# Altium schematic sheet 32.SchDoc
size A3
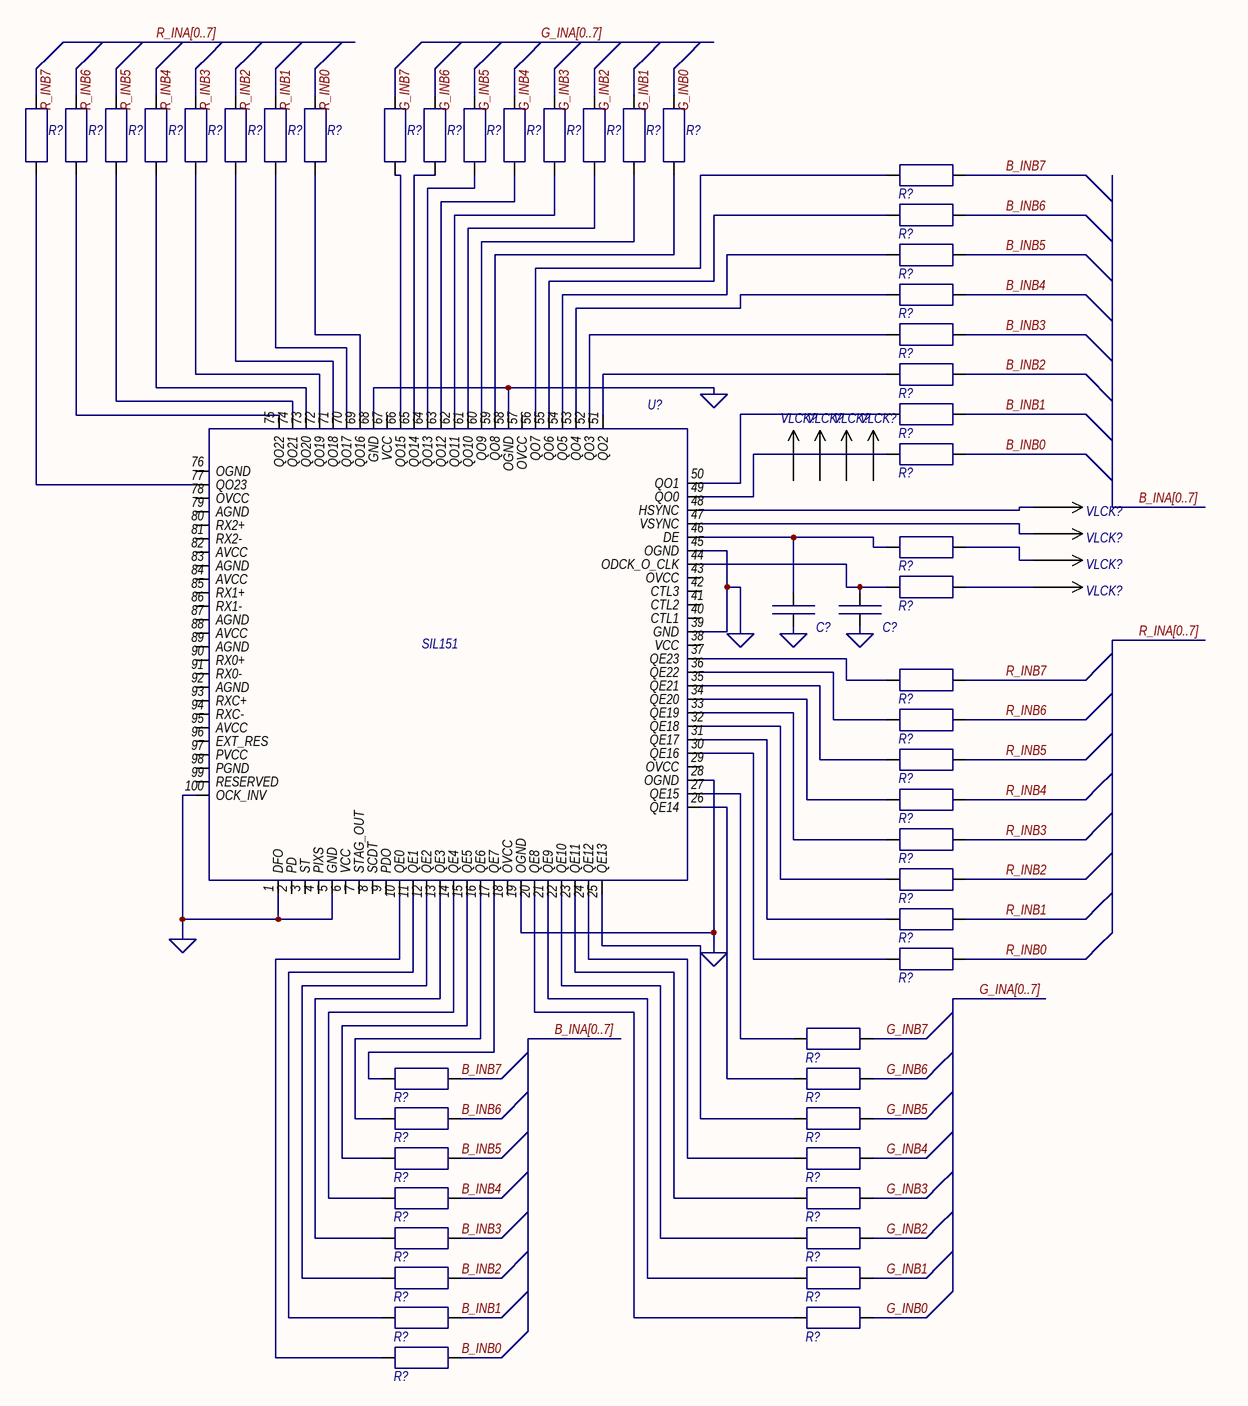
[diagram p0: 32.SchDoc]

## Parts
(Parts that share a designator on the sheet are numbered #1, #2 ... from top to bottom, then left to right.)
C?#1  Capacitor  [Cap_tantal_D]  (value not drawn)
C?#2  Capacitor  [Cap_tantal_D]  (value not drawn)
R?#1  Resistor  [R_1206]  (value not drawn)
R?#2  Resistor  [R_1206]  (value not drawn)
R?#3  Resistor  [R_1206]  (value not drawn)
R?#4  Resistor  [R_1206]  (value not drawn)
R?#5  Resistor  [R_1206]  (value not drawn)
R?#6  Resistor  [R_1206]  (value not drawn)
R?#7  Resistor  [R_1206]  (value not drawn)
R?#8  Resistor  [R_1206]  (value not drawn)
R?#9  Resistor  [R_1206]  (value not drawn)
R?#10  Resistor  [R_1206]  (value not drawn)
R?#11  Resistor  [R_1206]  (value not drawn)
R?#12  Resistor  [R_1206]  (value not drawn)
R?#13  Resistor  [R_1206]  (value not drawn)
R?#14  Resistor  [R_1206]  (value not drawn)
R?#15  Resistor  [R_1206]  (value not drawn)
R?#16  Resistor  [R_1206]  (value not drawn)
R?#17  Resistor  [R_1206]  (value not drawn)
R?#18  Resistor  [R_1206]  (value not drawn)
R?#19  Resistor  [R_1206]  (value not drawn)
R?#20  Resistor  [R_1206]  (value not drawn)
R?#21  Resistor  [R_1206]  (value not drawn)
R?#22  Resistor  [R_1206]  (value not drawn)
R?#23  Resistor  [R_1206]  (value not drawn)
R?#24  Resistor  [R_1206]  (value not drawn)
R?#25  Resistor  [R_1206]  (value not drawn)
R?#26  Resistor  [R_1206]  (value not drawn)
R?#27  Resistor  [R_1206]  (value not drawn)
R?#28  Resistor  [R_1206]  (value not drawn)
R?#29  Resistor  [R_1206]  (value not drawn)
R?#30  Resistor  [R_1206]  (value not drawn)
R?#31  Resistor  [R_1206]  (value not drawn)
R?#32  Resistor  [R_1206]  (value not drawn)
R?#33  Resistor  [R_1206]  (value not drawn)
R?#34  Resistor  [R_1206]  (value not drawn)
R?#35  Resistor  [R_1206]  (value not drawn)
R?#36  Resistor  [R_1206]  (value not drawn)
R?#37  Resistor  [R_1206]  (value not drawn)
R?#38  Resistor  [R_1206]  (value not drawn)
R?#39  Resistor  [R_1206]  (value not drawn)
R?#40  Resistor  [R_1206]  (value not drawn)
R?#41  Resistor  [R_1206]  (value not drawn)
R?#42  Resistor  [R_1206]  (value not drawn)
R?#43  Resistor  [R_1206]  (value not drawn)
R?#44  Resistor  [R_1206]  (value not drawn)
R?#45  Resistor  [R_1206]  (value not drawn)
R?#46  Resistor  [R_1206]  (value not drawn)
R?#47  Resistor  [R_1206]  (value not drawn)
R?#48  Resistor  [R_1206]  (value not drawn)
R?#49  Resistor  [R_1206]  (value not drawn)
R?#50  Resistor  [R_1206]  (value not drawn)
U?  SIL151
VLCK?#1  OutputArrow  (value not drawn)
VLCK?#2  OutputArrow  (value not drawn)
VLCK?#3  OutputArrow  (value not drawn)
VLCK?#4  OutputArrow  (value not drawn)
VLCK?#5  OutputArrow  (value not drawn)
VLCK?#6  OutputArrow  (value not drawn)
VLCK?#7  OutputArrow  (value not drawn)
VLCK?#8  OutputArrow  (value not drawn)

## Nets
GND: C?#1.1 C?#2.1 U?.1(DFO) U?.5(GND) U?.19(OGND) U?.28(OGND) U?.39(GND) U?.45(OGND) U?.58(OGND) U?.68(GND) U?.100(OCK_INV)
B_INB0: R?#24.2 R?#50.2
B_INB1: R?#23.2 R?#48.2
B_INB2: R?#22.2 R?#46.2
B_INB3: R?#21.2 R?#44.2
B_INB4: R?#20.2 R?#42.2
B_INB5: R?#19.2 R?#40.2
B_INB6: R?#18.2 R?#38.2
B_INB7: R?#1.2 R?#36.2
G_INA[0..7]: R?#13.2 R?#41.2  [also labelled G_INB4]
G_INB0: R?#17.2 R?#49.2
G_INB1: R?#16.2 R?#47.2
G_INB2: R?#15.2 R?#45.2
G_INB3: R?#14.2 R?#43.2
G_INB5: R?#12.2 R?#39.2
G_INB6: R?#11.2 R?#37.2
G_INB7: R?#10.2 R?#35.2
R_INB0: R?#9.2 R?#34.2
R_INB1: R?#8.2 R?#33.2
R_INB2: R?#7.2 R?#32.2
R_INB3: R?#6.2 R?#31.2
R_INB4: R?#5.2 R?#30.2
R_INB5: R?#4.2 R?#29.2
R_INB6: R?#3.2 R?#28.2
R_INB7: R?#2.2 R?#27.2
NetC?#1_2: C?#1.2 R?#25.1 U?.46(DE)
NetC?#2_2: C?#2.2 R?#26.1 U?.44(ODCK_O_CLK)
NetR?#1_1: R?#1.1 U?.56(QO7)
NetR?#2_1: R?#2.1 U?.77(QO23)
NetR?#3_1: R?#3.1 U?.75(QO22)
NetR?#4_1: R?#4.1 U?.74(QO21)
NetR?#5_1: R?#5.1 U?.73(QO20)
NetR?#6_1: R?#6.1 U?.72(QO19)
NetR?#7_1: R?#7.1 U?.71(QO18)
NetR?#8_1: R?#8.1 U?.70(QO17)
NetR?#9_1: R?#9.1 U?.69(QO16)
NetR?#10_1: R?#10.1 U?.66(QO15)
NetR?#11_1: R?#11.1 U?.65(QO14)
NetR?#12_1: R?#12.1 U?.64(QO13)
NetR?#13_1: R?#13.1 U?.63(QO12)
NetR?#14_1: R?#14.1 U?.62(QO11)
NetR?#15_1: R?#15.1 U?.61(QO10)
NetR?#16_1: R?#16.1 U?.60(QO9)
NetR?#17_1: R?#17.1 U?.59(QO8)
NetR?#18_1: R?#18.1 U?.55(QO6)
NetR?#19_1: R?#19.1 U?.54(QO5)
NetR?#20_1: R?#20.1 U?.53(QO4)
NetR?#21_1: R?#21.1 U?.52(QO3)
NetR?#22_1: R?#22.1 U?.51(QO2)
NetR?#23_1: R?#23.1 U?.50(QO1)
NetR?#24_1: R?#24.1 U?.49(QO0)
NetR?#25_2: R?#25.2 VLCK?#7.3
NetR?#26_2: R?#26.2 VLCK?#8.3
NetR?#27_1: R?#27.1 U?.37(QE23)
NetR?#28_1: R?#28.1 U?.36(QE22)
NetR?#29_1: R?#29.1 U?.35(QE21)
NetR?#30_1: R?#30.1 U?.34(QE20)
NetR?#31_1: R?#31.1 U?.33(QE19)
NetR?#32_1: R?#32.1 U?.32(QE18)
NetR?#33_1: R?#33.1 U?.31(QE17)
NetR?#34_1: R?#34.1 U?.30(QE16)
NetR?#35_1: R?#35.1 U?.27(QE15)
NetR?#36_1: R?#36.1 U?.17(QE7)
NetR?#37_1: R?#37.1 U?.26(QE14)
NetR?#38_1: R?#38.1 U?.16(QE6)
NetR?#39_1: R?#39.1 U?.25(QE13)
NetR?#40_1: R?#40.1 U?.15(QE5)
NetR?#41_1: R?#41.1 U?.24(QE12)
NetR?#42_1: R?#42.1 U?.14(QE4)
NetR?#43_1: R?#43.1 U?.23(QE11)
NetR?#44_1: R?#44.1 U?.13(QE3)
NetR?#45_1: R?#45.1 U?.22(QE10)
NetR?#46_1: R?#46.1 U?.12(QE2)
NetR?#47_1: R?#47.1 U?.21(QE9)
NetR?#48_1: R?#48.1 U?.11(QE1)
NetR?#49_1: R?#49.1 U?.20(QE8)
NetR?#50_1: R?#50.1 U?.10(QE0)
NetU?_47: U?.47(VSYNC) VLCK?#6.3
NetU?_48: U?.48(HSYNC) VLCK?#1.3

Not connected (* = marked no-connect by the designer): U? 2(PD) 3(ST) 4(PIXS) 6(VCC) 7(STAG_OUT) 8(SCDT) 9(PDO) 18(OVCC) 29(OVCC) 38(VCC) 40(CTL1) 41(CTL2) 42(CTL3) 43(OVCC) 57(OVCC) 67(VCC) 76(OGND) 78(OVCC) 79(AGND) 80(RX2+) 81(RX2-) 82(AVCC) 83(AGND) 84(AVCC) 85(RX1+) 86(RX1-) 87(AGND) 88(AVCC) 89(AGND) 90(RX0+) 91(RX0-) 92(AGND) 93(RXC+) 94(RXC-) 95(AVCC) 96(EXT_RES) 97(PVCC) 98(PGND) 99(RESERVED); VLCK?#2 3; VLCK?#3 3; VLCK?#4 3; VLCK?#5 3

## Buses and harness runs
bus B_INA[0..7]
bus G_INA[0..7]
bus R_INA[0..7]